# Altium schematic sheet USBINFRTransiever_Photodiod.SchDoc
size 420 x 297 mm; DocumentNumber: ФНКЦ.542321.001 Э3; SheetNumber: 2; Format: A3
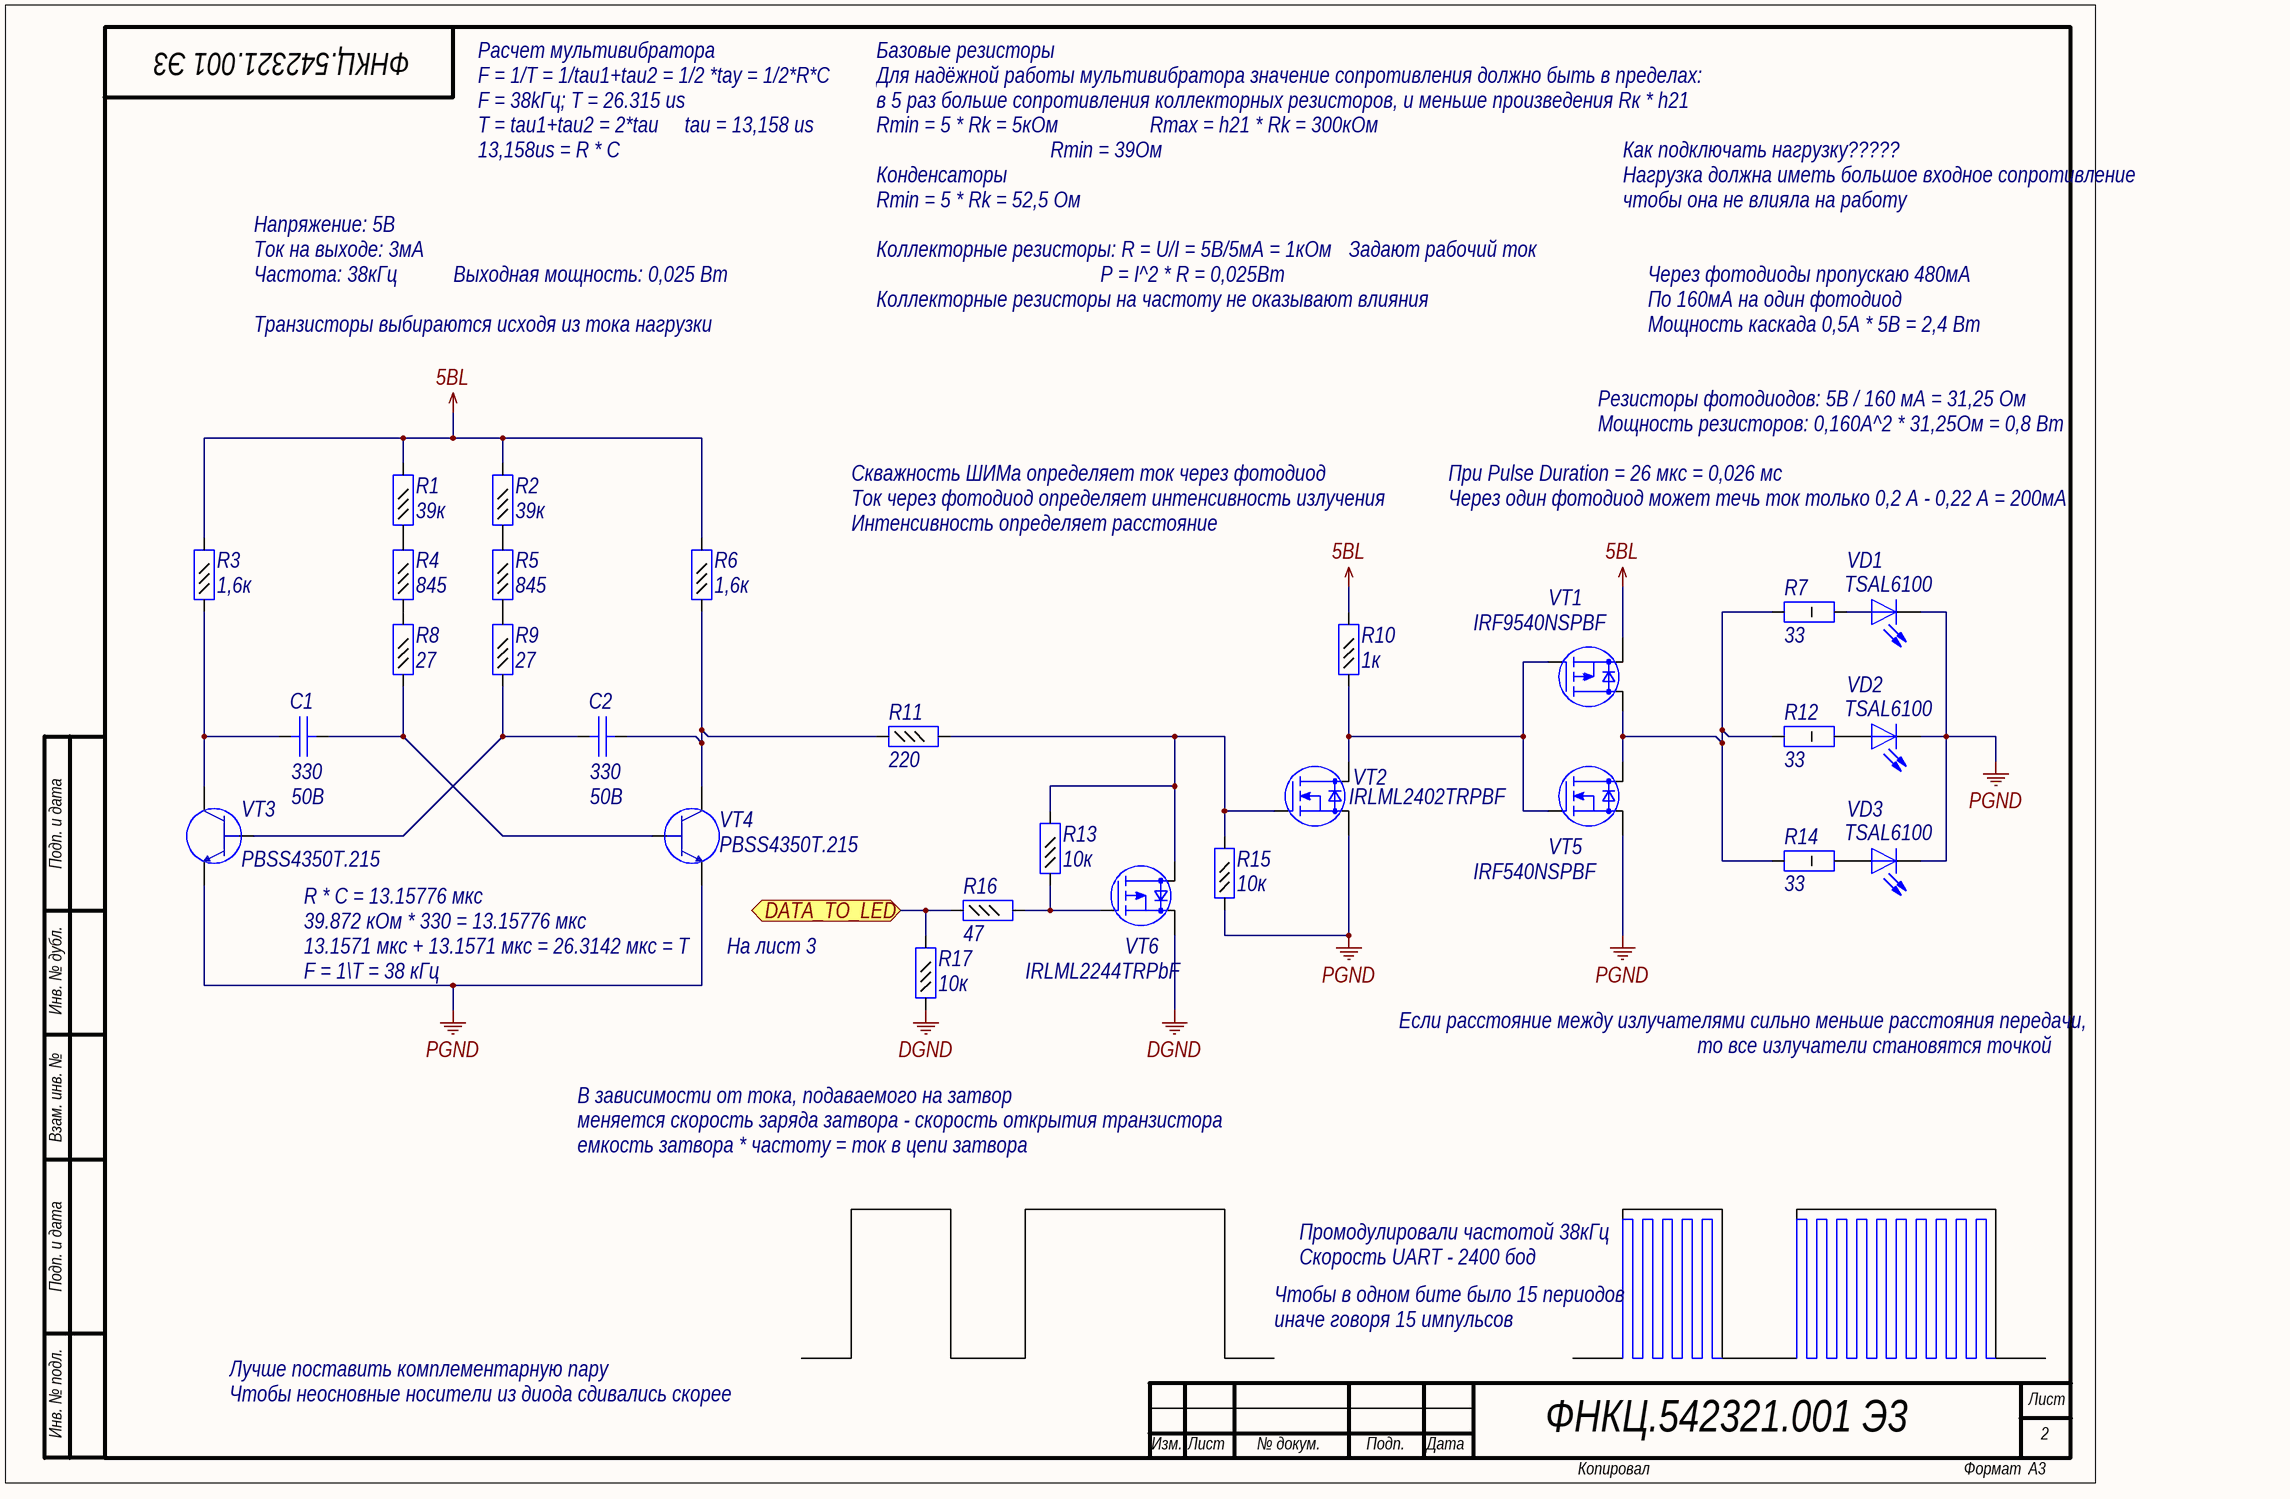
[diagram p0: USBINFRTransiever_Photodiod.SchDoc]

## Parts
C1  value 330  Voltage: 50В  [C0603]  (hidden comment: Capacitor)
C2  value 330  Voltage: 50В  [C0603]  (hidden comment: Capacitor)
R1  value 39к  [R0603]  (hidden comment: Resistor_0,062Вт)
R2  value 39к  [R0603]  (hidden comment: Resistor_0,062Вт)
R3  value 1,6к  [R0603]  (hidden comment: Resistor_0,062Вт)
R4  value 845  [R0603]  (hidden comment: Resistor_0,062Вт)
R5  value 845  [R0603]  (hidden comment: Resistor_0,062Вт)
R6  value 1,6к  [R0603]  (hidden comment: Resistor_0,062Вт)
R7  value 33  [R2512]  (hidden comment: Resistor_1Вт)
R8  value 27  [R0603]  (hidden comment: Resistor_0,062Вт)
R9  value 27  [R0603]  (hidden comment: Resistor_0,062Вт)
R10  value 1к  [R0603]  (hidden comment: Resistor_0,062Вт)
R11  value 220  [R0603]  (hidden comment: Resistor_0,062Вт)
R12  value 33  [R2512]  (hidden comment: Resistor_1Вт)
R13  value 10к  [R0603]  (hidden comment: Resistor_0,062Вт)
R14  value 33  [R2512]  (hidden comment: Resistor_1Вт)
R15  value 10к  [R0603]  (hidden comment: Resistor_0,062Вт)
R16  value 47  [R0603]  (hidden comment: Resistor_0,062Вт)
R17  value 10к  [R0603]  (hidden comment: Resistor_0,062Вт)
VD1  Part Number: TSAL6100  [RADIAL_5MM]  (hidden comment: LED)
VD2  Part Number: TSAL6100  [RADIAL_5MM]  (hidden comment: LED)
VD3  Part Number: TSAL6100  [RADIAL_5MM]  (hidden comment: LED)
VT1  Part Number: IRF9540NSPBF  [D2PAK]  (hidden comment: P-MOSFET)
VT2  Part Number: IRLML2402TRPBF  [SOT23-3]  (hidden comment: N-MOSFET)
VT3  Part Number: PBSS4350T.215  [SOT23-3]  (hidden comment: BJT NPN)
VT4  Part Number: PBSS4350T.215  [SOT23-3]  (hidden comment: BJT NPN)
VT5  Part Number: IRF540NSPBF  [D2PAK]  (hidden comment: N-MOSFET)
VT6  Part Number: IRLML2244TRPbF  [SOT23-3]  (hidden comment: P-MOSFET)

## Ports
DATA_TO_LED

## Nets
5ВL: R1.2 R2.2 R3.2 R6.2 R10.2 VT1.2(S)
DGND: R17.1 VT6.2(S)
PGND: R15.1 VD1.1(K) VD2.1(K) VD3.1(K) VT2.2(S) VT3.2 VT4.2 VT5.2(S)
DATA_TO_LED: R16.1 R17.2 ; port DATA_TO_LED
NetC1_1: C1.1 R3.1 VT3.3
NetC1_2: C1.2 R8.1 VT4.1
NetC2_1: C2.1 R9.1 VT3.1
NetC2_2: C2.2 R6.1 R11.1 VT4.3
NetR1_1: R1.1 R4.2
NetR2_1: R2.1 R5.2
NetR4_1: R4.1 R8.2
NetR5_1: R5.1 R9.2
NetR7_1: R7.1 R12.1 R14.1 VT1.3(D) VT5.3(D)
NetR7_2: R7.2 VD1.2(A)
NetR10_1: R10.1 VT1.1(G) VT2.3(D) VT5.1(G)
NetR11_2: R11.2 R13.2 R15.2 VT2.1(G) VT6.3(D)
NetR12_2: R12.2 VD2.2(A)
NetR13_1: R13.1 R16.2 VT6.1(G)
NetR14_2: R14.2 VD3.2(A)

## Notes on the sheet
- F = 1/T = 1/tau1+tau2 = 1/2 *tay = 1/2*R*C
- Расчет мультивибратора
- F = 38kГц; T = 26.315 us
- Базовые резисторы
- Для надёжной работы мультивибратора значение сопротивления должно быть в пределах:
- в 5 раз больше сопротивления коллекторных резисторов, и меньше произведения Rк * h21
- T = tau1+tau2 = 2*tau     tau = 13,158 us
- 13,158us = R * C
- Rmin = 5 * Rk = 5кОм
- Rmin = 39Ом
- Rmax = h21 * Rk = 300кОм
- Как подключать нагрузку?????
- Напряжение: 5В
- Конденсаторы
- Rmin = 5 * Rk = 52,5 Ом
- Нагрузка должна иметь большое входное сопротивление
- чтобы она не влияла на работу
- Частота: 38кГц
- Ток на выходе: 3мА
- Выходная мощность: 0,025 Вт
- Коллекторные резисторы на частоту не оказывают влияния
- Коллекторные резисторы: R = U/I = 5B/5мА = 1кОм
- P = I^2 * R = 0,025Вт
- Задают рабочий ток
- По 160мА на один фотодиод
- Через фотодиоды пропускаю 480мА
- Транзисторы выбираются исходя из тока нагрузки
- Мощность каскада 0,5А * 5В = 2,4 Вт
- Резисторы фотодиодов: 5В / 160 мА = 31,25 Ом
- Мощность резисторов: 0,160А^2 * 31,25Ом = 0,8 Вт
- Скважность ШИМа определяет ток через фотодиод
- При Pulse Duration = 26 мкс = 0,026 мс
- Ток через фотодиод определяет интенсивность излучения
- Интенсивность определяет расстояние
- Через один фотодиод может течь ток только 0,2 А - 0,22 А = 200мА
- Подп. и дата
- (near VT4) 39.872 кОм * 330 = 13.15776 мкc
- R * C = 13.15776 мкc
- Инв. № дубл.
- 13.1571 мкc + 13.1571 мкc = 26.3142 мкс = Т
- F = 1\T = 38 кГц
- На лист 3
- Если расстояние между излучателями сильно меньше расстояния передачи,
- то все излучатели становятся точкой
- Взам. инв. №
- В зависимости от тока, подаваемого на затвор
- меняется скорость заряда затвора - скорость открытия транзистора
- емкость затвора * частоту = ток в цепи затвора
- Промодулировали частотой 38кГц
- Чтобы в одном бите было 15 периодов
- Скорость UART - 2400 бод
- Лучше поставить комплементарную пару
- иначе говоря 15 импульсов
- Инв. № подл.
- Чтобы неосновные носители из диода сдивались скорее
- Лист
- Изм.
- № докум.
- Подп.
- Дата
- Копировал
- Формат

## Library data of the parts
C1 C2 = cap215: Конденсатор; Part Name: Ceramic; Manufacture: Murata; Part Number: GRM188R71H331KA01D; id: cap215; TKE: X7R
R1 R2 = res497: Резистор; Manufacture: Yageo; Part Number: RC0603FR-0739KL; id: res497; Accuracy: 1%; Part Name: Resistor; Power: 0,062Вт
R3 R6 = res464: Резистор; Manufacture: Yageo; Part Number: RC0603FR-071K6; id: res464; Accuracy: 1%; Part Name: Resistor; Power: 0,062Вт
R4 R5 = res971: Резистор; Manufacture: Yageo; Part Number: RC0603FR-07845RL; id: res971; Part Name: Resistor; Power: 0,062Вт
R7 R12 R14 = res809: Резистор; Manufacture: Yageo; Part Number: RC2512FR-0733RL; id: res809; Accuracy: 1%; Power: 1Вт; Part Name: Resistor
R8 R9 = res421: Резистор; Manufacture: Yageo; Part Number: RC0603FR-0727RL; id: res421; Accuracy: 1%; Part Name: Resistor; Power: 0,062Вт
R10 = res459: Резистор; Manufacture: Yageo; Part Number: RC0603FR-071KL; id: res459; Accuracy: 1%; Part Name: Resistor; Power: 0,062Вт
R11 = res443: Резистор; Manufacture: Yageo; Part Number: RC0603FR-07220RL; id: res443; Accuracy: 1%; Part Name: Resistor; Power: 0,062Вт
R13 R15 R17 = res483: Резистор; Manufacture: Yageo; Part Number: RC0603FR-0710KL; id: res483; Accuracy: 1%; Part Name: Resistor; Power: 0,062Вт
R16 = res427: Резистор; Manufacture: Yageo; Part Number: RC0603FR-0747RL; id: res427; Accuracy: 1%; Part Name: Resistor; Power: 0,062Вт
VD1-VD3 = phdiode1: Светодиод; Part Name: High Power Infrared Emitting Diode; Manufacture: Vishay; Max Reverse Voltage: 5B; Forward Voltage: 1,35-2,6B; Forward Current: 100mA; Surge Forward Current: 1,5A(impulse - 100us); Radiant intensity: 80-400,1450mW/sr; Radiant power: 35mW; Angle of half intensity: (+-)10; Peak wavelength: 940nm; Number of Channels: 1; id: phdiode1
VT1 = trans6: N-MOSFET; Part Name: Transistor; Manufacturer: International Rectifier; id: trans6; Structure: p-channel; V drain-source max: (-100B); Rds: 0,117Ohm; Gate-to-source voltage: (+-)20B; Continuous drain current: (-23)A; Pulsed drain current: (-92)A; Power dissipation: 140W
VT2 = trans2: Part Name: Transistor; Manufacturer: International Rectifier; id: trans2; Structure: n-channel; V drain-source max: 20B; Rds: 0,25Ohm; Gate-to-source voltage: (+-)12B; Continuous drain current: 1,2A; Pulsed drain current: 7,4A; Power dissipation: 0,54W
VT3 VT4 = bjt5: Part Name: Transistor; Manufacture: NXP Semiconductor; id: bjt5; hfe: 300; Vceo max: 50В; Ic max: 2А; Power: 0,48Вт; Frequency: 100МГц; Structure: npn
VT5 = trans7: Part Name: Transistor; Manufacturer: International Rectifier; id: trans7; Structure: n-channel; V drain-source max: 100B; Rds: 0,044Ohm; Gate-to-source voltage: (+-)20B; Continuous drain current: 33A; Pulsed drain current: 110A; Power dissipation: 130W
VT6 = trans5: N-MOSFET; Part Name: Transistor; Manufacturer: International Rectifier; id: trans5; Structure: p-channel; V drain-source max: (-20B); Rds: 0,054Ohm; Gate-to-source voltage: (+-)12B; Continuous drain current: (-4,3)A; Pulsed drain current: (-18)A; Power dissipation: 1,3W